# Altium schematic sheet Sheet1.SchDoc
size A4
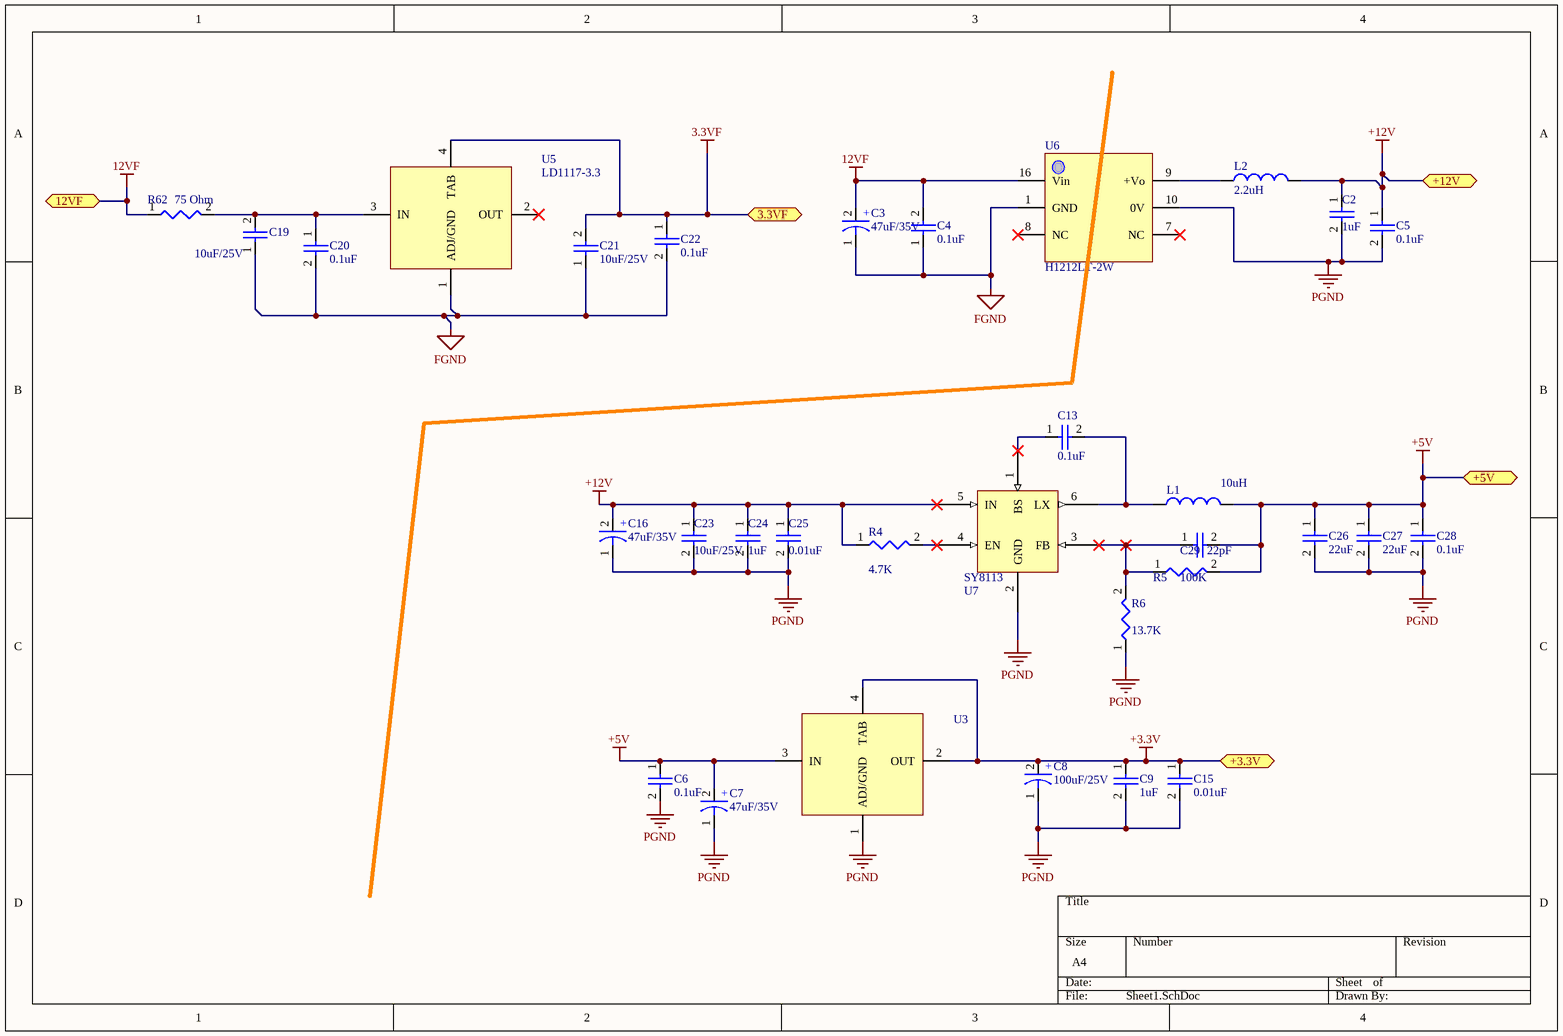
[diagram p0: Sheet1.SchDoc]

## Parts
C2  value 1uF  [C0805]  (hidden comment: CAP)
C3  value 47uF/35V  [CA6_6x5_8]  (hidden comment: CAPACITOR)
C4  value 0.1uF  [C0603]  (hidden comment: CAP)
C5  value 0.1uF  [C0603]  (hidden comment: CAP)
C6  value 0.1uF  [C0805]  (hidden comment: CAP)
C7  value 47uF/35V  [CA6_6x5_8]  (hidden comment: CAPACITOR)
C8  value 100uF/25V  [CA6_6x7_7]  (hidden comment: CAPACITOR)
C9  value 1uF  [C0805]  (hidden comment: CAP)
C13  value 0.1uF  [C0603]  (hidden comment: CAP)
C15  value 0.01uF  [C0805]  (hidden comment: CAP)
C16  value 47uF/35V  [CA6_6x5_8]  (hidden comment: CAPACITOR)
C19  value 10uF/25V  [C1206]  (hidden comment: CAP)
C20  value 0.1uF  [C0805]  (hidden comment: CAP)
C21  value 10uF/25V  [C1206]  (hidden comment: CAP)
C22  value 0.1uF  [C0805]  (hidden comment: CAP)
C23  value 10uF/25V  [C1206]  (hidden comment: CAP)
C24  value 1uF  [C0805]  (hidden comment: CAP)
C25  value 0.01uF  [C0805]  (hidden comment: CAP)
C26  value 22uF  [C1210]  (hidden comment: CAP)
C27  value 22uF  [C1210]  (hidden comment: CAP)
C28  value 0.1uF  [C0603]  (hidden comment: CAP)
C29  value 22pF  [C0805]  (hidden comment: CAP)
L1  value 10uH  [1038]  (hidden comment: Inductor)
L2  value 2.2uH  [L0805]  (hidden comment: Inductor)
R4  value 4.7K  [R0603]  (hidden comment: RES)
R5  value 100K  [R0603]  (hidden comment: RES)
R6  value 13.7K  [R0603]  (hidden comment: RES)
R62  value 75 Ohm  [R2512]  (hidden comment: RES)
U3  LD1117-3.3  [AS1117]  (value not drawn)
U5  LD1117-3.3  [DPAK-134]
U6  H1212LT-2W  [H_LT-2W]
U7  SY8113  [TSOT23-6L]

## Ports
3.3VF, 12VF, +3.3V, +5V, +12V

## Nets
3.3VF: C21.2 C22.1 U5.4(TAB) ; port 3.3VF
12VF: C3.2 C4.2 R62.1 U6.16(Vin) ; port 12VF
+3.3V: C8.2 C9.1 C15.1 U3.2(OUT) U3.4(TAB) ; port +3.3V
+5V: C6.1 C7.2 C26.1 C27.1 C28.1 C29.2 L1.2 R5.2 U3.3(IN) ; port +5V
+12V: C2.1 C5.1 C16.2 C23.1 C24.1 C25.1 L2.2 R4.1 U7.5(IN) ; port +12V
FGND: C3.1 C4.1 C19.1 C20.2 C21.1 C22.2 U5.1(ADJ/GND) U6.1(GND)
PGND: C2.2 C5.2 C6.2 C7.1 C8.1 C9.2 C15.2 C16.1 C23.2 C24.2 C25.2 C26.2 C27.2 C28.2 R6.1 U3.1(ADJ/GND) U6.10(0V) U7.2(GND)
NetC13_1: C13.1 U7.1(BS)
NetC13_2: C13.2 L1.1 U7.6(LX)
NetC19_2: C19.2 C20.1 R62.2 U5.3(IN)
NetC29_1: C29.1 R5.1 R6.2 U7.3(FB)
NetL2_1: L2.1 U6.9(+Vo)
NetR4_2: R4.2 U7.4(EN)

Not connected (* = marked no-connect by the designer): U5 2(OUT)*; U6 7(NC)* 8(NC)*

## Notes on the sheet
- (in symbol EC00073) +
- (in symbol EC00074) +

## Library data of the parts
C2 C9 C24 = EC00002: CAP SMD CR X7R 50V 10% 1uF 0805 ROHS; Manufacturer: YAGEO; Manufacturer P/N: CC0805KKX7R9BB105; ID: 2; HelpURL: *; P/N: EC00002
C3 C7 C16 = EC00074: CAP SMD AL 35V 20% 47uF Low_ESR F61 ROHS; Manufacturer: NIPPON CHEMI-CON; Manufacturer P/N: EMZJ350ADA470MF61G; ID: 74; Type: ****; HelpURL: \\192.168.1.3\Esh\Department\RD\CAD\Component\Capacitor\smd\nippon_al-mzj-c-111201.pdf; P/N: EC00074
C4 C5 C13 C28 = EC00093: CAP SMD XR7 50V 10% 100nF 0603 ROHS; Manufacturer: YAGEO; Manufacturer P/N: CC0603KRX7R9BB104; ID: 93; HelpURL: *; P/N: EC00093
C6 C20 C22 = EC00014: CAP SMD CR X7R 50V 10% 0.1uF 0805 ROHS; Manufacturer: YAGEO; Manufacturer P/N: CC0805KRX7R9BB104; ID: 14; HelpURL: *; P/N: EC00014
C8 = EC00073: CAP SMD AL 25V 20% 100uF Low_ESR F80 ROHS; Manufacturer: NIPPON CHEMI-CON; Manufacturer P/N: EMZJ250ADA101MF80G; ID: 73; Type: ****; HelpURL: \\192.168.1.3\Esh\Department\RD\CAD\Component\Capacitor\smd\nippon_al-mzj-c-111201.pdf; P/N: EC00073
C15 C25 = EC00018: CAP SMD CR X7R 50V 10% 10nF 0805 ROHS; Manufacturer: Murata; Manufacturer P/N: GRM216R71H103KA01D; ID: 18; HelpURL: *; P/N: EC00018
C19 C21 C23 = EC00088: CAP,CMCC,10uF,25V,10%,X7R,1206,SMD,ROHS; Manufacturer: Murata; Manufacturer P/N: GRM31CR71E106KA12L; ID: 88; Type: ****; HelpURL: \\192.168.1.3\Esh\Department\RD\CAD\Component\Capacitor\smd\Murata_GRM31CR71E106KA12L.pdf; P/N: EC00088
C26 C27 = EC00124: CAP SMD MLCC X7R 16V 22uF 20% 1210 ROHS; Manufacturer: Murata; Manufacturer P/N: GRM32ER71C226MEA8#; ID: 124; Type: ****; HelpURL: *; P/N: EC00124
C29 = EC00015: CAP SMD C0G 50V 10% 22pF 0805 ROHS; Manufacturer: Murata; Manufacturer P/N: GQM2195C1H220JB01B; ID: 15; HelpURL: *; P/N: EC00015
L1 = EL00022: INDUCTOR 10uH 3.6A 30% SMD 1038 ROHS; Manufacturer: Wuerth Electronic; Manufacturer P/N: 744066100; ID: 22; HelpURL: http://katalog.we-online.de/pbs/datasheet/744066100.pdf; P/N: EL00022
L2 = EL00005: INDUCTOR 2.2uH 0.5A 20% SMD 0805 ROHS; Manufacturer: Wuerth Electronic; Manufacturer P/N: 74479775222; ID: 5; Type: ****; HelpURL: \\192.168.1.3\Esh\Department\RD\CAD\Component\Inductor\WE_74479775222.pdf; P/N: EL00005
R4 = ER00176: RES THICK_FILM 4.7K 5% 1/10W ROHS 0603; Manufacturer: YAGEO; Manufacturer P/N: RC0603JR-074K7L; ID: 176; HelpURL: \\192.168.1.3\Esh\Department\RD\CAD\Component\Resistor\Leaded-R_MFR_2011.pdf; P/N: ER00176
R5 = ER00221: RES,THIN_FILM,100K,1%	,1/16W,±50ppm/℃,ROHS,0603,SMD; Manufacturer: VIKING; Manufacturer P/N: AR03FTDY1003; ID: 221; HelpURL: *; P/N: ER00221
R6 = ER00220: RES,THIN_FILM,13.7K,1%	,1/16W,±50ppm/℃,ROHS,0603,SMD; Manufacturer: VIKING; Manufacturer P/N: AR03FTDY1372; ID: 220; HelpURL: *; P/N: ER00220
R62 = ER00212: RES THICK_FILM SMD 75 ohm 5% 1W ROHS 2512; Manufacturer: YAGEO; Manufacturer P/N: RC2512JK-0775RL; ID: 212; HelpURL: \\192.168.1.3\Esh\Department\RD\CAD\Component\Resistor\SMD\YAGEO_PYu-RC1206_51_RoHS_L_4.pdf; P/N: ER00212
U3 = EU00006: IC REG VOLT +3.3V LDO 800MA SOT223 ROHS; Manufacturer: ST; Manufacturer P/N: LD1117S33CTR; ID: 6; HelpURL: \\192.168.1.3\Esh\Department\RD\CAD\Component\Power_DC_to_DC\LD1117_ST.pdf; Value: LD1117-3.3; P/N: EU00006; Type: *****
U5 = EU00066: IC REG VOLT +3.3V LDO 800MA DPAK ROHS; Manufacturer P/N: LD1117DT33TR; Manufacturer: ST; ID: 66; HelpURL: \\192.168.1.3\Esh\Department\RD\CAD\Component\Power_DC_to_DC\LD1117_ST.pdf; P/N: EU00066; Value: LD1117-3.3; Type: *****
U6 = EU00069: IC DC/DC,12V->12V,2W,ISOLATION:6000VDC,23.86X18.10X8MM,ROHS; Manufacturer: Mornsun; ID: 69; HelpURL: \\192.168.1.3\Esh\Department\RD\CAD\Component\Power_DC_to_DC\Isolated\H_RN-2W & H_LT-2W_CN.pdf; P/N: EU00069; Manufacturer P/N: H1212LT-2W; Value: H1212LT-2W; Type: *****
U7 = EU00068: Regulator,500KHz,3A,18V Input,Synchronous Step Down,TSOT23-6; Manufacturer P/N: SY8113ADC; Manufacturer: SILERGY; ID: 68; Value: SY8113ADC; HelpURL: \\192.168.1.3\Esh\Department\RD\CAD\Component\Power_DC_to_DC\AN_SY8113_Internal_cee.pdf; P/N: EU00068; Type: *****